# EAGLE design LDR (EAGLE 7.6.0)
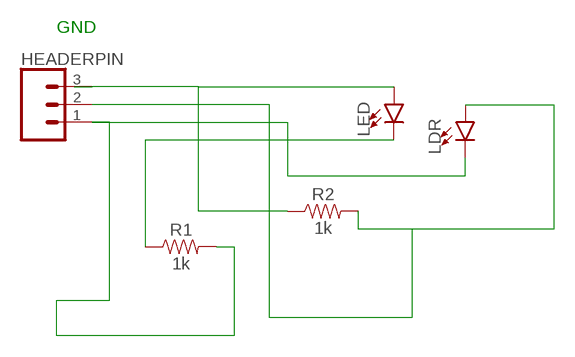
[diagram p0: schematic, sheet 1]

## Parts
HEADERPIN  CONN_03  [1X03]
LDR  LED5MM  [LED_5MM]
LED  LED5MM  [LED_5MM]
R1  1k  1KOHM-HORIZ-1/4W-5%  [AXIAL-0.3]
R2  1k  1KOHM-HORIZ-1/4W-5%  [AXIAL-0.3]

## Nets
N$1: HEADERPIN.3 LED.A R2.P$1
N$2: LED.K(C) R1.P$1
N$3: HEADERPIN.1 LDR.K(C) R1.P$2
N$4: HEADERPIN.2 LDR.A R2.P$2

## Notes on the sheet
- GND

## Library data of the parts
HEADERPIN = SparkFun-Connectors:CONN_03: Multi connection point. Often used as Generic Header-pin footprint for 0.1 inch spaced/style header connections On any of the 0.1 inch spaced packages, you can populate with these: Break Away Headers - Straight <https://www.sparkfun.com/products/116> (PRT-00116) Break Away Male Headers - Right Angle <https://www.sparkfun.com/products/553> (PRT-00553) Female Headers <https://www.sparkfun.com/products/115> (PRT-00115) Break Away Headers - Machine Pin <https://www.sparkfun.com/products/117> (PRT-00117) Break Away Female Headers - Swiss Machine Pin <https://www.sparkfun.com/products/743> (PRT-00743) Stackable Header - 3 Pin (Female, 0.1") <https://www.sparkfun.com/products/13875> (PRT-13875) For SCREWTERMINALS and SPRING TERMINALS visit here: Screw Terimnals on SparkFun.com <https://www.sparkfun.com/search/results?term=Screw+Terminals> (5mm/3.5mm/2.54mm spacing) This device is also useful as a general connection point to wire up your design to another part of your project. Our various solder wires solder well into these plated through hole pads. Hook-Up Wire - Assortment (Stranded, 22 AWG) <https://www.sparkfun.com/products/11375> (PRT-11375) Hook-Up Wire - Assortment (Solid Core, 22 AWG) <https://www.sparkfun.com/products/11367> (PRT-11367) View the entire wire category on our website here <https://www.sparkfun.com/categories/141> Special notes: Molex polarized connector foot print use with SKU : PRT-08232 with associated crimp pins and housings.
LDR LED = SparkFun-LED:LED: LED (Generic) Standard schematic elements and footprints for 5mm, 3mm, 1206, and 0603 sized LEDs. Generic LEDs with no color specified.
R1 R2 = SparkFun-Resistors:1KOHM: 1kΩ resistor A resistor is a passive two-terminal electrical component that implements electrical resistance as a circuit element. Resistors act to reduce current flow, and, at the same time, act to lower voltage levels within circuits. - Wikipedia; PROD_ID: RES-08380

## Board
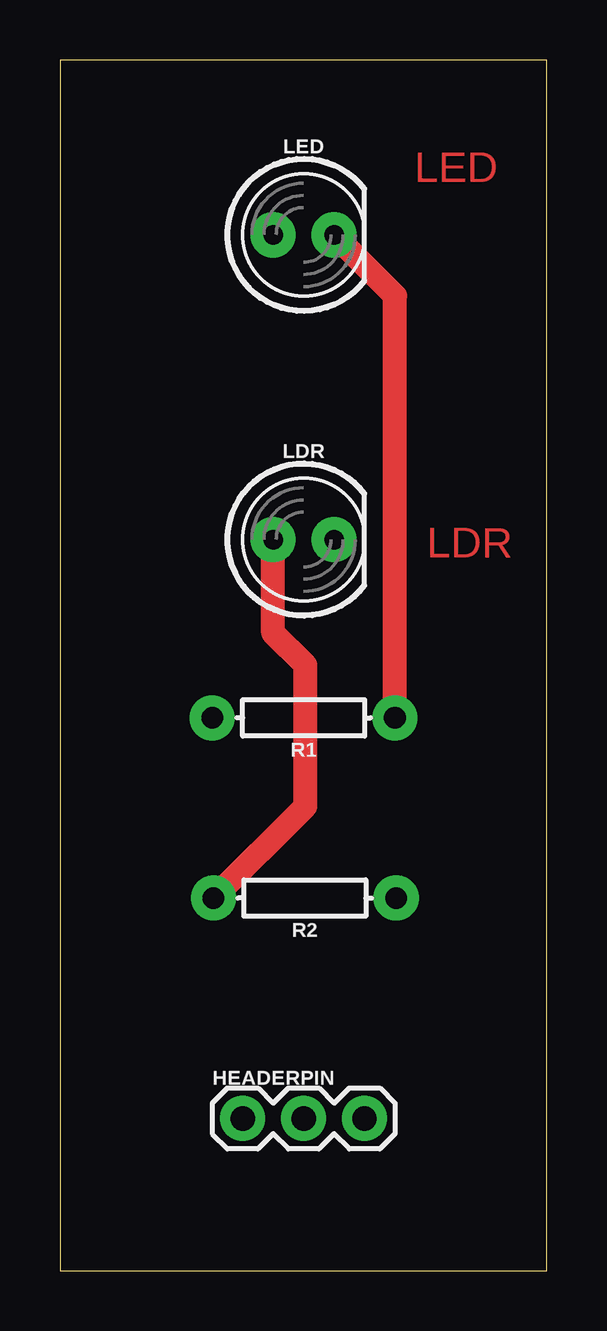
[diagram p1: board, top side]
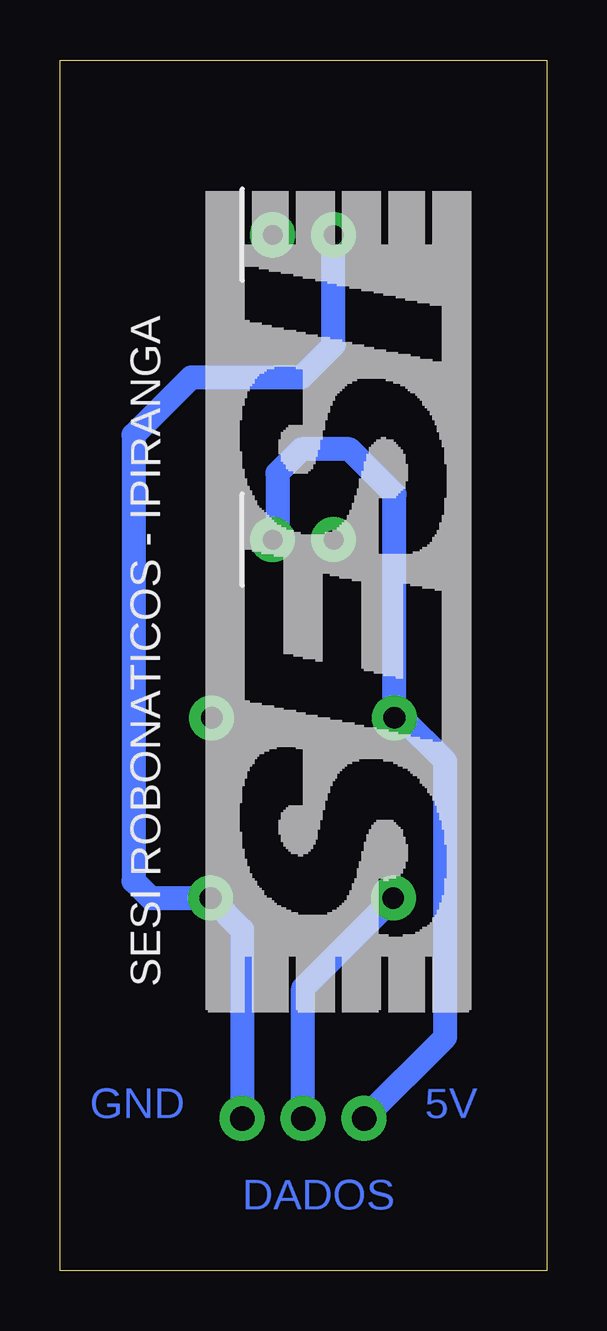
[diagram p2: board, bottom side, seen from below]

Size 20.3 x 50.47 mm. Coordinates in mm from the lower left corner, seen from the top.
Outline: 0,0 20.3,0 20.3,50.47 0,50.47 0,0
Copper layers (1*16): Top 0.035mm / dielectric 1.5mm / Bottom 0.035mm
Design rules "default": minimum track width 10mil, minimum drill 24mil, track to track 8mil, track to pad 8mil, pad to pad 8mil, via to via 8mil, smd to smd 8mil, copper to edge 40mil, drill to drill 8mil, minimum pad ring 10mil, minimum via ring 8mil, stop-mask expansion 4mil, vias tented up to drill 0mil, thermal gap 10mil

### Footprints (pad centres in the part's own frame; a part is rotated, then mirrored left to right if it is on the bottom)
1X03 = drill 1.016 pad 1.88: 1 0,0; 2 2.54,0; 3 5.08,0
LED_5MM = drill 0.813 pad 1.88: A -1.27,0; K 1.27,0
AXIAL-0.3 = drill 0.9 pad 1.88: P$1 -3.81,0; P$2 3.81,0

### Placement (x,y rotation side)
HEADERPIN  7.62,6.35 0 top
LDR  10.16,30.48 0 top
LED  10.16,43.18 0 top
R1  10.16,23.05 180 top
R2  10.21,15.54 180 top

### Tracks (layer width: path | path; a pad name or v marks a point on that pad's centre or on a via)
N$1
  Bottom 1: HEADERPIN.3 12.7,14.22 R2.P$1 16.52,15.54 17.23,16.25 17.23,34.84 14.82,37.25 10.23,37.25 8.89,38.59 LED.A
N$2
  Top 1: R1.P$1 13.97,40.64 LED.K
N$3
  Bottom 1: HEADERPIN.1 4.23,9.74 4.23,21.25 6.03,23.05 R1.P$2 6.35,32.37 8.23,34.25 10.23,34.25 11.23,33.25 11.23,30.68 LDR.K
N$4
  Top 1: R2.P$2 10.23,19.37 10.23,25.25 8.89,26.59 LDR.A
  Bottom 1: HEADERPIN.2 10.16,11.78 R2.P$2

### Text on the board
Top: LED | LDR
Bottom: 5V | GND | DADOS
bPlace: SESI ROBONATICOS - IPIRANGA